# Altium schematic sheet VoltageMeasurement.SchDoc
size A4; SheetNumber: 1; SheetTotal: 3; Schematic: Voltage Measurement
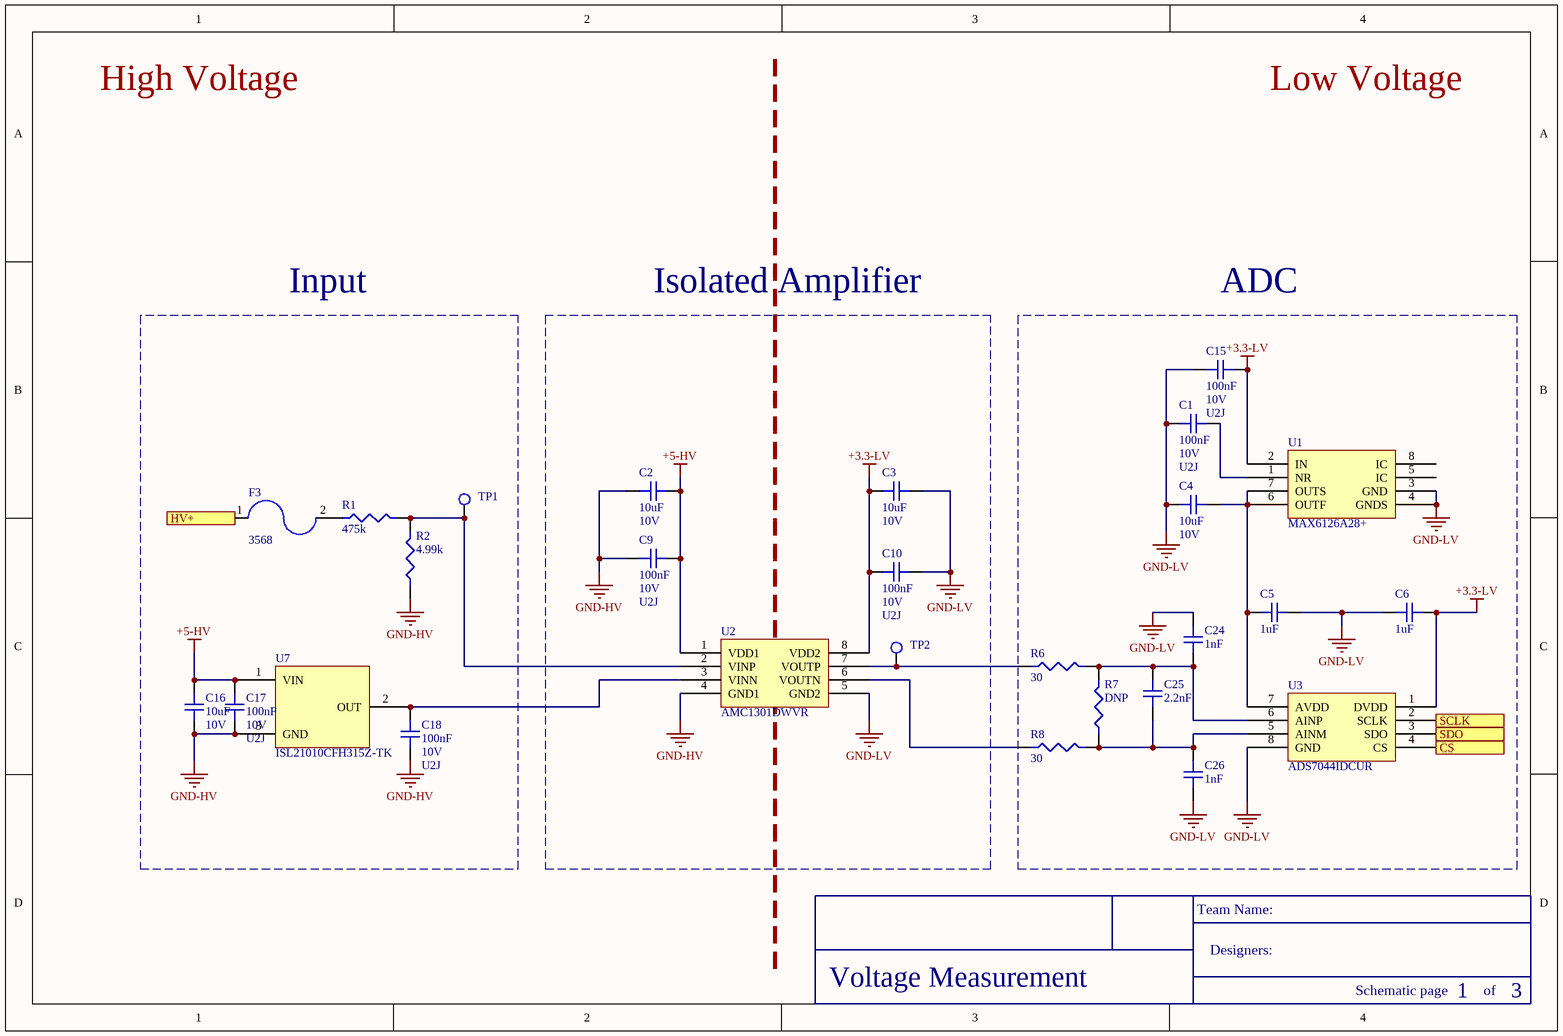
[diagram p0: VoltageMeasurement.SchDoc]

## Parts
C1  100nF  Voltage Rating: 10V  Dielectric: U2J  [C0805]
C2  10uF  Voltage Rating: 10V  [C0805]
C3  10uF  Voltage Rating: 10V  [C0805]
C4  10uF  Voltage Rating: 10V  [C0805]
C5  1uF  [C0805]
C6  1uF  [C0805]
C9  100nF  Voltage Rating: 10V  Dielectric: U2J  [C0805]
C10  100nF  Voltage Rating: 10V  Dielectric: U2J  [C0805]
C15  100nF  Voltage Rating: 10V  Dielectric: U2J  [C0805]
C16  10uF  Voltage Rating: 10V  [C0805]
C17  100nF  Voltage Rating: 10V  Dielectric: U2J  [C0805]
C18  100nF  Voltage Rating: 10V  Dielectric: U2J  [C0805]
C24  1nF  [C1206]
C25  2.2nF  [C0805]
C26  1nF  [C1206]
F3  3568  [FUSE_MINI_HOLDER]
R1  475k  [Res-475k-RNF18FTD475K]
R2  4.99k  [R0805]
R6  30  [R0805]
R7  DNP  [R0805]
R8  30  [R0805]
TP1  5015  [TP_HOOK]  (value not drawn)
TP2  5015  [TP_HOOK]  (value not drawn)
U1  MAX6126A28+  [REF5030IDGKT]
U2  AMC1301DWVR  [AMC1301DWVR]
U3  ADS7044IDCUR  [ADS7044IDCUR]
U7  ISL21010CFH315Z-TK  [ISL21010CFH315Z-TK]

## Blocks framed on the sheet
Input: C16-C18 F3 R1 R2 TP1 U7
Isolated Amplifier: C2 C3 C9 C10 TP2 U2
ADC: C1 C4-C6 C15 C24-C26 R6-R8 U1 U3

## Ports
CS, HV+, SCLK, SDO

## Nets
+3.3-LV: C3.1 C6.2 C10.1 C15.2 U1.2(IN) U2.8(VDD2) U3.1(DVDD)
+5-HV: C2.1 C9.1 C16.2 C17.2 U2.1(VDD1) U7.1(VIN)
GND-HV: C2.2 C9.2 C16.1 C17.1 C18.1 R2.1 U2.4(GND1) U7.3(GND)
GND-LV: C1.1 C3.2 C4.1 C5.2 C6.1 C10.2 C15.1 C24.2 C26.1 U1.3(GND) U1.4(GNDS) U2.5(GND2) U3.8(GND)
CS: U3.4(CS) ; port CS
HV+: F3.1 ; port HV+
SCLK: U3.2(SCLK) ; port SCLK
SDO: U3.3(SDO) ; port SDO
NetC1_2: C1.2 U1.1(NR)
NetC4_2: C4.2 C5.1 U1.6(OUTF) U1.7(OUTS) U3.7(AVDD)
NetC18_2: C18.2 U2.3(VINN) U7.2(OUT)
NetC24_1: C24.1 C25.2 R6.2 R7.2 U3.6(AINP)
NetC25_1: C25.1 C26.2 R7.1 R8.2 U3.5(AINM)
NetF3_2: F3.2 R1.1
NetR1_2: R1.2 R2.2 TP1.1 U2.2(VINP)
NetR6_1: R6.1 TP2.1 U2.7(VOUTP)
NetR8_1: R8.1 U2.6(VOUTN)

Not connected (* = marked no-connect by the designer): U1 5(IC) 8(IC)

## Notes on the sheet
- High Voltage
- Low Voltage
- Team Name:
- Designers:
- Schematic page
- of

## Library data of the parts
C1 C9 C10 C15 C17 C18 = GRM21B7U1A104JA01L: CAP MLCC 100nF 10Volts U2J 5%; Manufacturer: Murata; Supplier 1: Digi-Key; Manufacturer Part Number: GRM21B7U1A104JA01L; Stock 1: 6000; Pricing 1: 1=0.46, 10=0.32, 100=0.192, 500=0.144, 1000=0.1216 (USD); Mount: Surface Mount; Case/Package: 0805; Case Code (Imperial): 0805; Case Code (Metric): 2012; Min Operating Temperature: -55°C; Max Operating Temperature: 125°C; Capacitance: 100nF; Voltage Rating (DC): 10V; Tolerance: 5%; Packaging: Tape and Reel; Package Quantity: 3000; Termination: SMD/SMT; Length: 2mm; Height: 1.25mm; Width: 0.049inch; Thickness: 0.053inch; Depth: 1.25mm; Radiation Hardening: No; ComponentLink1URL: https://datasheet.ciiva.com/5424/product-5424660.pdf; ComponentLink1Description: https://datasheet.ciiva.com/5424/product-5424660.pdf; ComponentLink2URL: https://datasheet.ciiva.com/17451/product-17451845.pdf; ComponentLink2Description: https://datasheet.ciiva.com/17451/product-17451845.pdf; ComponentLink3URL: https://datasheet.ciiva.com/11618/product-11618924.pdf; ComponentLink3Description: https://datasheet.ciiva.com/11618/product-11618924.pdf; Supplier Part Number 1: 490-11592-6-ND
C2-C4 C16 = GCM21BR71A106KE22L: CAP CER 10UF 10V X7R 0805; Manufacturer: Murata; Tolerance: 10%; OP Temp Range: -55-125; Supplier 1: Digi-Key; Capacitance: 10uF; Supplier Part Number 1: 490-10674-1-ND; Package: 0805; Temp Coef: X7R
C5 C6 = GCM21BR71C105KA58K: CAP CER 1UF 16V X7R 0805; Manufacturer: Murata; Supplier 1: Digi-Key; Manufacturer Part Number: GCM21BR71C105KA58K
C24 C26 = CC1206KKX7RCBB102: CAP MLCC 1000PF 1KV X7R 1206 Series Comm. Isolation Caps; Manufacturer: Yageo; Supplier 1: Digi-Key; Manufacturer Part Number: CC1206KKX7RCBB102
C25 = GCJ21AR72E222KXJ1D: CAP CER 2200PF 250V X7R 0805; Manufacturer: Murata; Supplier 1: Digi-Key; Manufacturer Part Number: GCJ21AR72E222KXJ1D
F3 = 3568: FUSE HOLDER MINI AUTO PC; Manufacturer: Keystone Electronics; Colour: Black; Material: Brass,Nickel,Tin,Nylon; Body Material: Nylon; Current Rating: 20A; Voltage Rating (AC): 500V; Number of Poles: 1; Illumination Type: Illuminated; Fuse Type: Automotive; Approvals: UL; Supplier 1: Digi-Key; Manufacturer Part Number: 3568; Stock 1: 69840; Pricing 1: 1=0.98, 10=0.853, 50=0.7694, 100=0.7359, 250=0.669, 1000=0.599, 2500=0.502, 5000=0.4683 (USD); Mount: Vertical,PCB; Contact Material: Brass,Nickel,Tin; Contact Plating: Tin; Min Operating Temperature: -50°C; Max Operating Temperature: 145°C; Package Quantity: 1; Number of Circuits: 1; Voltage: 500V; Termination: PC Pin; Fuse Current: 20A; Orientation: Vertical; Length: 16mm; Depth: 6.73mm; REACH SVHC: No SVHC; Lead Free: Lead Free; Flammability Rating: UL94 V-0; ComponentLink1URL: https://datasheet.ciiva.com/16294/m60-2p40-16294706.pdf; ComponentLink1Description: https://datasheet.ciiva.com/16294/m60-2p40-16294706.pdf; ComponentLink2URL: https://datasheet.ciiva.com/16874/70182101-16874378.pdf; ComponentLink2Description: https://datasheet.ciiva.com/16874/70182101-16874378.pdf; Supplier Part Number 1: 36-3568-ND
R1 = RNF18FTD475K: RES 475K OHM 1/8W 1% AXIAL; Power: 0.125W; Temp Coef: 100ppm/C; Op Temp Range: -55-155; Supplier 1: Digi-Key; Tolerance: 1%; Supplier Part Number 1: RNF18FTD475KCT-ND; Package: axial
R2 = ERA-6AEB4991V: RES 4.99K OHM 0.1% 1/8W 0805; Power: 0.125W; Temp Coef: 25ppm/C; Op Temp Range: -55-155; Supplier 1: Digi-Key; Supplier Part Number 1: P4.99KDACT-ND; Tolerance: 0.1%; Package: 0805
R6 R8 = ERJ-6ENF30R0V: RES SMD 30 OHM 1% 1/8W 0805; Manufacturer: Panasonic; Supplier 1: Digi-Key; Manufacturer Part Number: ERJ-6ENF30R0V
R7 = DNP: RES 0805 DNP; Value: DNP
TP1 TP2 = 5015: TEST POINT, PCB, SMT; Manufacturer: Keystone Electronics; Number of Ports: 1; Supplier 1: Digi-Key; Manufacturer Part Number: 5015; Stock 1: 1937775; Pricing 1: 1=0.44, 10=0.421, 25=0.3604, 50=0.3064, 100=0.2944, 250=0.2644, 500=0.2524 (USD); Mount: Surface Mount; Colour: White; Contact Material: Bronze; Contact Plating: Tin,Silver,Lead; Material: Bronze,Silver; Package Quantity: 1; Packaging: Tape and Reel; Termination: Solder; Orientation: Straight; Length: 2.66mm; Height: 0.06inch; Thickness: 0.01inch; Depth: 1.01mm; REACH SVHC: No SVHC; Lead Free: Lead Free; ComponentLink1URL: https://datasheet.ciiva.com/2917/5015-2917616.pdf; ComponentLink1Description: https://datasheet.ciiva.com/2917/5015-2917616.pdf; ComponentLink2URL: https://datasheet.ciiva.com/2917/5015-2917617.pdf; ComponentLink2Description: https://datasheet.ciiva.com/2917/5015-2917617.pdf; ComponentLink3URL: https://datasheet.ciiva.com/1123/5015-1123862.pdf; ComponentLink3Description: https://datasheet.ciiva.com/1123/5015-1123862.pdf; ComponentLink4URL: https://datasheet.ciiva.com/16883/70182998-16883734.pdf; ComponentLink4Description: https://datasheet.ciiva.com/16883/70182998-16883734.pdf; Supplier Part Number 1: 36-5015CT-ND
U1 = MAX6126A28+: IC VREF SERIES 0.06% 8UMAX; Manufacturer: Maxim Integrated; Supplier 1: Digi-Key; Manufacturer Part Number: MAX6126A28+
U2 = AMC1301DWVR: IC OPAMP ISOLATION 1 CIRC 8 SOIC; Manufacturer: Texas Instruments; Supplier 1: Digi-Key; Manufacturer Part Number: AMC1301DWVR; Case/Package: SOIC; Number of Pins: 8; ComponentLink1Description: DataSheet; ComponentLink1URL: http://www.ti.com/general/docs/suppproductinfo.tsp?distId=10&gotoUrl=http%3A%2F%2Fwww.ti.com%2Flit%2Fgpn%2Famc1301
U3 = ADS7044IDCUR: IC ADC 12BIT SAR 8VSSOP; Manufacturer: Texas Instruments; Supplier 1: Digi-Key; Manufacturer Part Number: ADS7044IDCUR
U7 = ISL21010CFH315Z-TK: IC VREF SERIES 0.2% SOT23-3; Supplier 1: Digi-Key